# EAGLE design f1 (EAGLE 9.5.0)
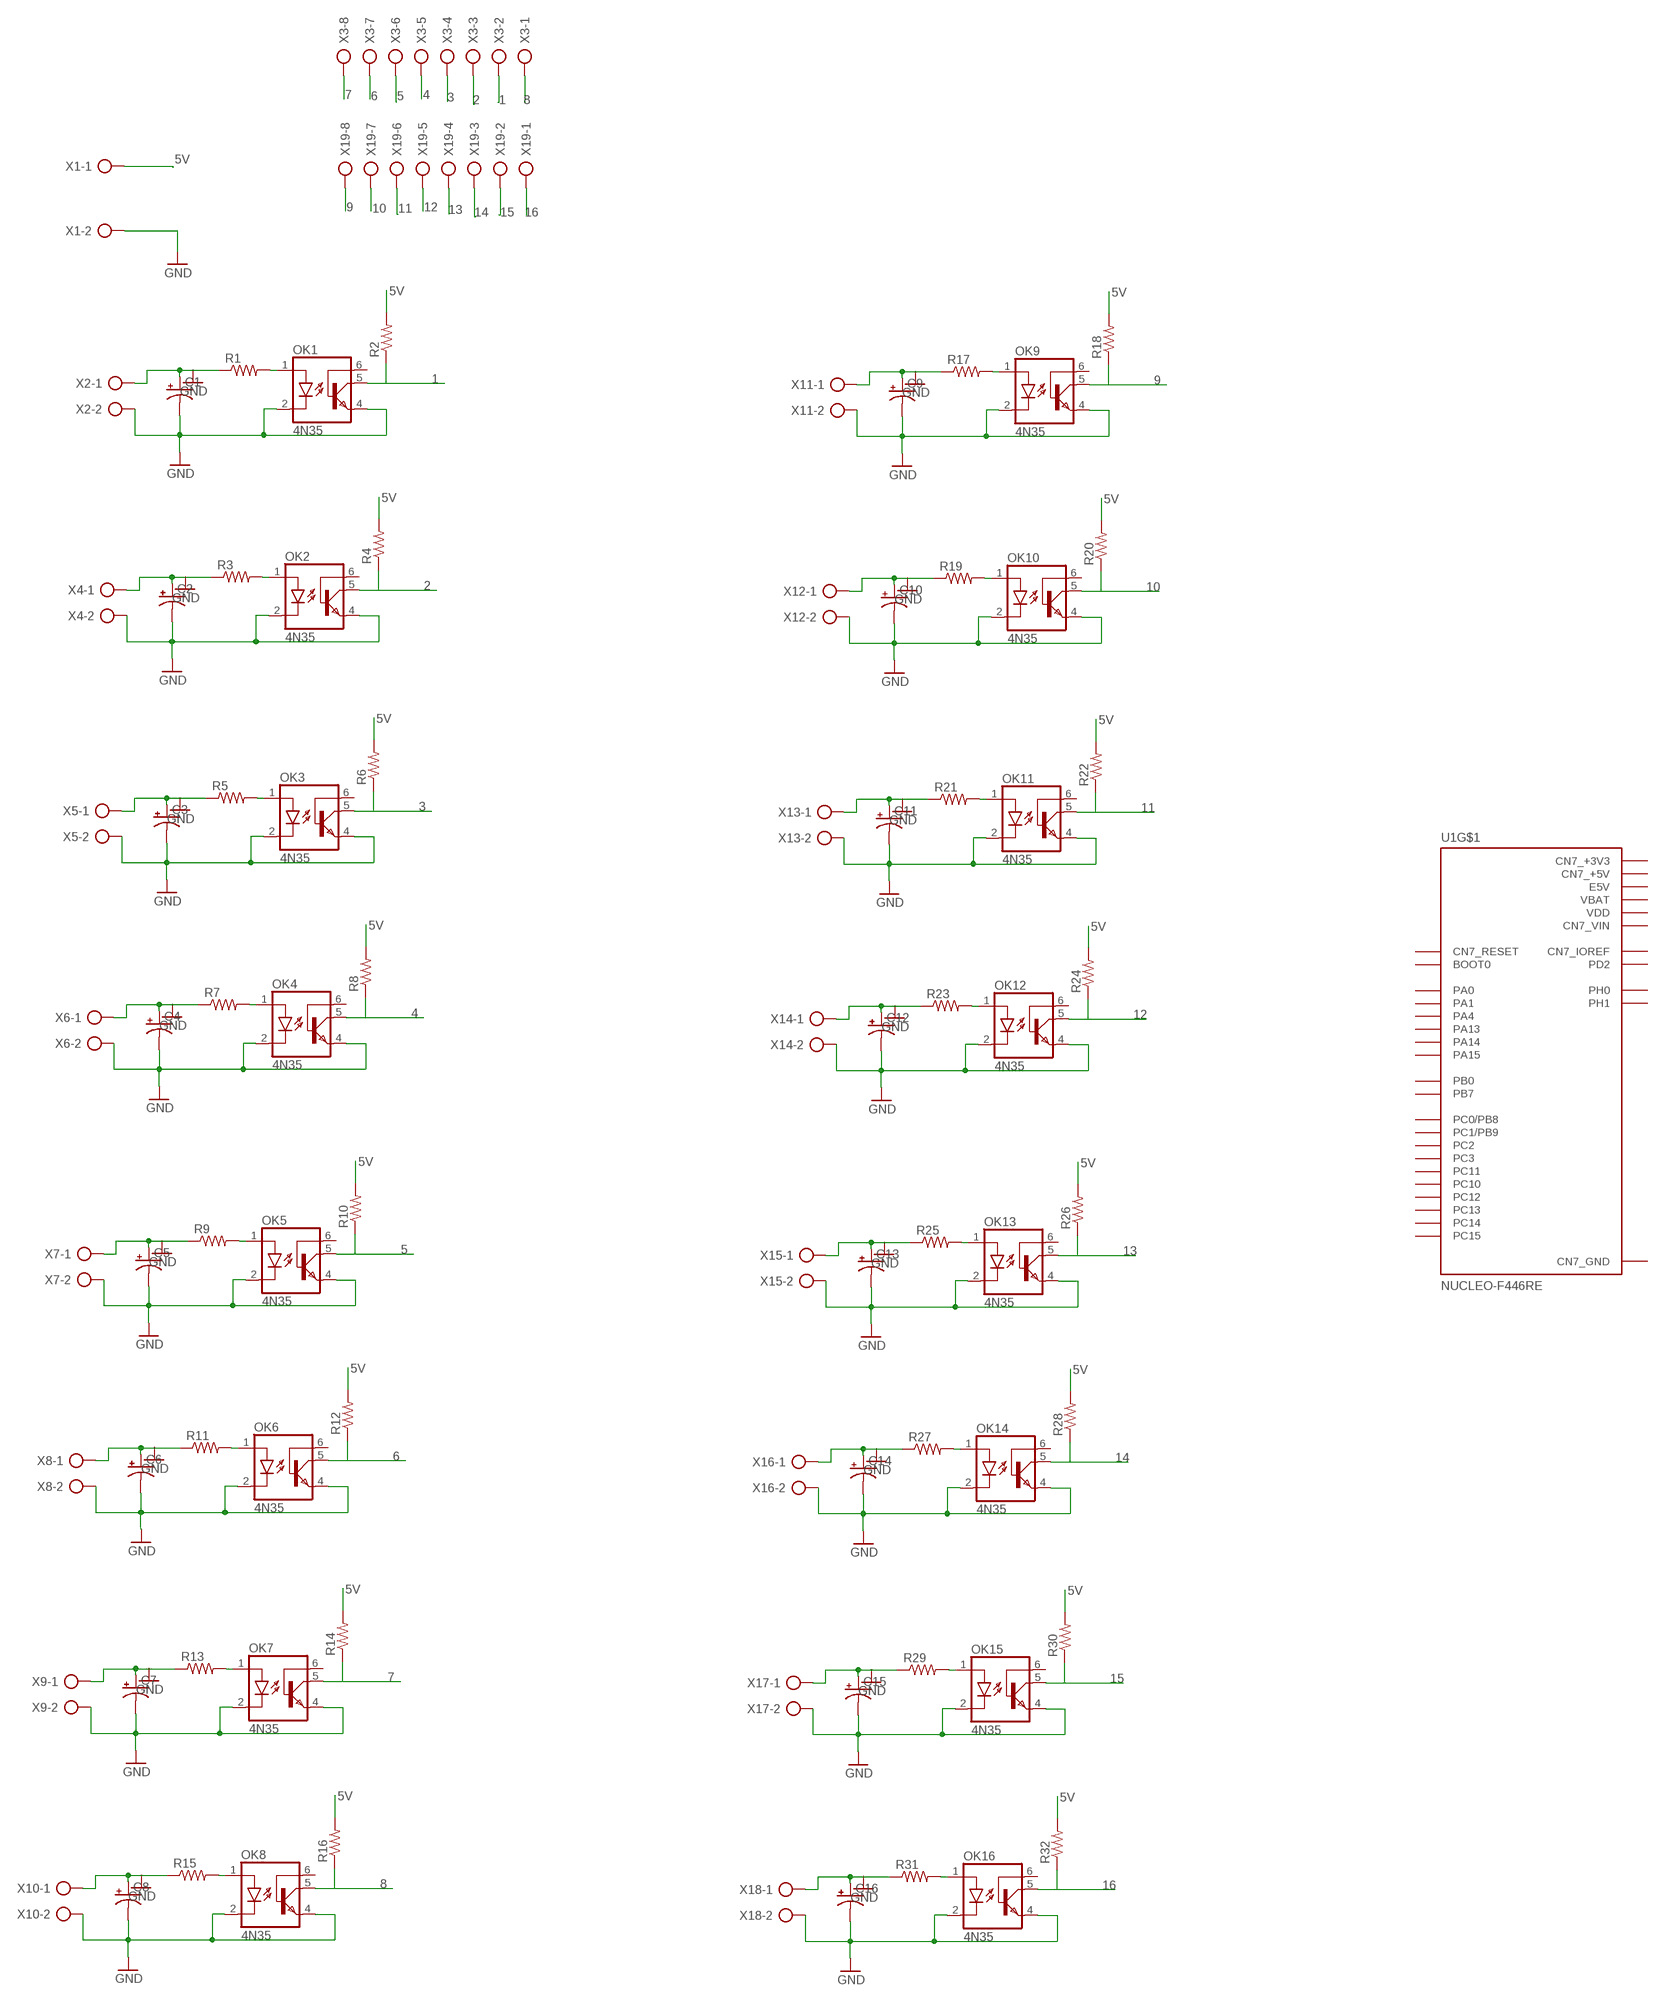
[diagram p0: schematic, sheet 1]

## Parts
C1  CPOL-USE3.5-10  [E3,5-10]
C2  CPOL-USE3.5-10  [E3,5-10]
C3  CPOL-USE3.5-10  [E3,5-10]
C4  CPOL-USE3.5-10  [E3,5-10]
C5  CPOL-USE3.5-10  [E3,5-10]
C6  CPOL-USE3.5-10  [E3,5-10]
C7  CPOL-USE3.5-10  [E3,5-10]
C8  CPOL-USE2.5-6  [E2,5-6]
C9  CPOL-USE3.5-10  [E3,5-10]
C10  CPOL-USE3.5-10  [E3,5-10]
C11  CPOL-USE3.5-10  [E3,5-10]
C12  CPOL-USE3.5-10  [E3,5-10]
C13  CPOL-USE3.5-10  [E3,5-10]
C14  CPOL-USE3.5-10  [E3,5-10]
C15  CPOL-USE3.5-10  [E3,5-10]
C16  CPOL-USE3.5-10  [E3,5-10]
OK1  4N35  [DIL06]
OK2  4N35  [DIL06]
OK3  4N35  [DIL06]
OK4  4N35  [DIL06]
OK5  4N35  [DIL06]
OK6  4N35  [DIL06]
OK7  4N35  [DIL06]
OK8  4N35  [DIL06]
OK9  4N35  [DIL06]
OK10  4N35  [DIL06]
OK11  4N35  [DIL06]
OK12  4N35  [DIL06]
OK13  4N35  [DIL06]
OK14  4N35  [DIL06]
OK15  4N35  [DIL06]
OK16  4N35  [DIL06]
R1  R-US_0207/10  [0207/10]
R2  R-US_0207/10  [0207/10]
R3  R-US_0207/10  [0207/10]
R4  R-US_0207/10  [0207/10]
R5  R-US_0207/10  [0207/10]
R6  R-US_0207/10  [0207/10]
R7  R-US_0207/10  [0207/10]
R8  R-US_0207/10  [0207/10]
R9  R-US_0207/10  [0207/10]
R10  R-US_0207/10  [0207/10]
R11  R-US_0207/10  [0207/10]
R12  R-US_0207/10  [0207/10]
R13  R-US_0207/10  [0207/10]
R14  R-US_0207/10  [0207/10]
R15  R-US_0207/10  [0207/10]
R16  R-US_0207/10  [0207/10]
R17  R-US_0207/10  [0207/10]
R18  R-US_0207/10  [0207/10]
R19  R-US_0207/10  [0207/10]
R20  R-US_0207/10  [0207/10]
R21  R-US_0207/10  [0207/10]
R22  R-US_0207/10  [0207/10]
R23  R-US_0207/10  [0207/10]
R24  R-US_0207/10  [0207/10]
R25  R-US_0207/10  [0207/10]
R26  R-US_0207/10  [0207/10]
R27  R-US_0207/10  [0207/10]
R28  R-US_0207/10  [0207/10]
R29  R-US_0207/10  [0207/10]
R30  R-US_0207/10  [0207/10]
R31  R-US_0207/10  [0207/10]
R32  R-US_0207/10  [0207/10]
U1  NUCLEO-F446RE  [MODULE_NUCLEO-F446RE]
X1  AK300/2  [AK300/2]
X2  AK300/2  [AK300/2]
X3  AK300/8  [AK300/8]
X4  AK300/2  [AK300/2]
X5  AK300/2  [AK300/2]
X6  AK300/2  [AK300/2]
X7  AK300/2  [AK300/2]
X8  AK300/2  [AK300/2]
X9  AK300/2  [AK300/2]
X10  AK300/2  [AK300/2]
X11  AK300/2  [AK300/2]
X12  AK300/2  [AK300/2]
X13  AK300/2  [AK300/2]
X14  AK300/2  [AK300/2]
X15  AK300/2  [AK300/2]
X16  AK300/2  [AK300/2]
X17  AK300/2  [AK300/2]
X18  AK300/2  [AK300/2]
X19  AK300/8  [AK300/8]

## Nets
1: OK1.5(COL) R2.1 X3.2
2: OK2.5(COL) R4.1 X3.3
3: OK3.5(COL) R6.1 X3.4
4: OK4.5(COL) R8.1 X3.5
5: OK5.5(COL) R10.1 X3.6
5V: R2.2 R4.2 R6.2 R8.2 R10.2 R12.2 R14.2 R16.2 R18.2 R20.2 R22.2 R24.2 R26.2 R28.2 R30.2 R32.2 X1.1
6: OK6.5(COL) R12.1 X3.7
7: OK7.5(COL) R14.1 X3.8
8: OK8.5(COL) R16.1 X3.1
9: OK9.5(COL) R18.1 X19.8
10: OK10.5(COL) R20.1 X19.7
11: OK11.5(COL) R22.1 X19.6
12: OK12.5(COL) R24.1 X19.5
13: OK13.5(COL) R26.1 X19.4
14: OK14.5(COL) R28.1 X19.3
15: OK15.5(COL) R30.1 X19.2
16: OK16.5(COL) R32.1 X19.1
GND: C1.- C2.- C3.- C4.- C5.- C6.- C7.- C8.- C9.- C10.- C11.- C12.- C13.- C14.- C15.- C16.- OK1.2(C) OK1.4(EMI) OK2.2(C) OK2.4(EMI) OK3.2(C) OK3.4(EMI) OK4.2(C) OK4.4(EMI) OK5.2(C) OK5.4(EMI) OK6.2(C) OK6.4(EMI) OK7.2(C) OK7.4(EMI) OK8.2(C) OK8.4(EMI) OK9.2(C) OK9.4(EMI) OK10.2(C) OK10.4(EMI) OK11.2(C) OK11.4(EMI) OK12.2(C) OK12.4(EMI) OK13.2(C) OK13.4(EMI) OK14.2(C) OK14.4(EMI) OK15.2(C) OK15.4(EMI) OK16.2(C) OK16.4(EMI) X1.2 X2.2 X4.2 X5.2 X6.2 X7.2 X8.2 X9.2 X10.2 X11.2 X12.2 X13.2 X14.2 X15.2 X16.2 X17.2 X18.2
N$1: C2.+ R3.1 X4.1
N$2: OK2.1(A) R3.2
N$5: C3.+ R5.1 X5.1
N$6: C1.+ R1.1 X2.1
N$7: OK1.1(A) R1.2
N$13: OK3.1(A) R5.2
N$14: C4.+ R7.1 X6.1
N$15: OK4.1(A) R7.2
N$16: C5.+ R9.1 X7.1
N$17: OK5.1(A) R9.2
N$18: C6.+ R11.1 X8.1
N$19: OK6.1(A) R11.2
N$20: C7.+ R13.1 X9.1
N$21: OK7.1(A) R13.2
N$22: C8.+ R15.1 X10.1
N$23: OK8.1(A) R15.2
N$24: C9.+ R17.1 X11.1
N$25: OK9.1(A) R17.2
N$26: C10.+ R19.1 X12.1
N$27: OK10.1(A) R19.2
N$28: C11.+ R21.1 X13.1
N$29: OK11.1(A) R21.2
N$30: C12.+ R23.1 X14.1
N$31: OK12.1(A) R23.2
N$32: C13.+ R25.1 X15.1
N$33: OK13.1(A) R25.2
N$34: C14.+ R27.1 X16.1
N$35: OK14.1(A) R27.2
N$36: C15.+ R29.1 X17.1
N$37: OK15.1(A) R29.2
N$38: C16.+ R31.1 X18.1
N$39: OK16.1(A) R31.2
Unconnected: OK1.6(BAS) OK2.6(BAS) OK3.6(BAS) OK4.6(BAS) OK5.6(BAS) OK6.6(BAS) OK7.6(BAS) OK8.6(BAS) OK9.6(BAS) OK10.6(BAS) OK11.6(BAS) OK12.6(BAS) OK13.6(BAS) OK14.6(BAS) OK15.6(BAS) OK16.6(BAS) U1.CN5_1(D8) U1.CN5_2(D9) U1.CN5_3(D10) U1.CN5_4(D11) U1.CN5_5(D12) U1.CN5_6(D13) U1.CN5_9(D14) U1.CN5_10(D15) U1.CN6_2(CN6_IOREF) U1.CN6_3(CN6_RESET) U1.CN7_1(PC10) U1.CN7_2(PC11) U1.CN7_3(PC12) U1.CN7_4(PD2) U1.CN7_7(BOOT0) U1.CN7_12(CN7_IOREF) U1.CN7_13(PA13) U1.CN7_14(CN7_RESET) U1.CN7_15(PA14) U1.CN7_17(PA15) U1.CN7_21(PB7) U1.CN7_23(PC13) U1.CN7_25(PC14) U1.CN7_27(PC15) U1.CN7_28(PA0) U1.CN7_29(PH0) U1.CN7_30(PA1) U1.CN7_31(PH1) U1.CN7_32(PA4) U1.CN7_34(PB0) U1.CN7_35(PC2) U1.CN7_36(PC1/PB9) U1.CN7_37(PC3) U1.CN7_38(PC0/PB8) U1.CN8_1(A0) U1.CN8_2(A1) U1.CN8_3(A2) U1.CN8_4(A3) U1.CN8_5(A4) U1.CN8_6(A5) U1.CN9_1(D0) U1.CN9_2(D1) U1.CN9_3(D2) U1.CN9_4(D3) U1.CN9_5(D4) U1.CN9_6(D5) U1.CN9_7(D6) U1.CN9_8(D7) U1.CN10_1(PC9) U1.CN10_2(PC8) U1.CN10_3(PB8) U1.CN10_4(PC6) U1.CN10_5(PB9) U1.CN10_6(PC5) U1.CN10_11(PA5) U1.CN10_12(PA12) U1.CN10_13(PA6) U1.CN10_14(PA11) U1.CN10_15(PA7) U1.CN10_16(PB12) U1.CN10_17(PB6) U1.CN10_19(PC7) U1.CN10_21(PA9) U1.CN10_22(PB2) U1.CN10_23(PA8) U1.CN10_24(PB1) U1.CN10_25(PB10) U1.CN10_26(PB15) U1.CN10_27(PB4) U1.CN10_28(PB14) U1.CN10_29(PB5) U1.CN10_30(PB13) U1.CN10_31(PB3) U1.CN10_33(PA10) U1.CN10_34(PC4) U1.CN10_35(PA2) U1.CN10_37(PA3)

## Power pins joined to a net without a drawn wire
AGND: U1.CN10_32(AGND)
AREF: U1.CN5_8(AREF)
AVDD: U1.CN10_7(AVDD)
CN5_GND: U1.CN5_7(CN5_GND)
CN6_+3V3: U1.CN6_4(CN6_+3V3)
CN6_+5V: U1.CN6_5(CN6_+5V)
CN6_GND: U1.CN6_6(CN6_GND) U1.CN6_7(CN6_GND)
CN6_VIN: U1.CN6_8(CN6_VIN)
CN7_+3V3: U1.CN7_16(CN7_+3V3)
CN7_+5V: U1.CN7_18(CN7_+5V)
CN7_GND: U1.CN7_8(CN7_GND) U1.CN7_19(CN7_GND) U1.CN7_20(CN7_GND) U1.CN7_22(CN7_GND)
CN7_VIN: U1.CN7_24(CN7_VIN)
CN10_GND: U1.CN10_9(CN10_GND) U1.CN10_20(CN10_GND)
E5V: U1.CN7_6(E5V)
U5V: U1.CN10_8(U5V)
VBAT: U1.CN7_33(VBAT)
VDD: U1.CN7_5(VDD)

## Library data of the parts
C1-C16 = rcl:CPOL-US: POLARIZED CAPACITOR, American symbol; SPICEPREFIX: C
OK1-OK16 = optocoupler:4N35: MOTOROLA OPTO COUPLER; MF: FAIRCHILD SEMICONDUCTOR; MPN: 4N35; OC_FARNELL: 1328375; OC_NEWARK: 72K9946
R1-R32 = rcl:R-US_: RESISTOR, American symbol; SPICEPREFIX: R
U1 = NUCLEO-F446RE:NUCLEO-F446RE: STM32 Nucleo-64 development board with STM32F446RET6 MCU, supports Arduino and ST morpho connectivity Check prices <https://pricing.snapeda.com/parts/NUCLEO-F446RE/STMicroelectronics/view-part?ref=eda>; AVAILABILITY: Warning; DESCRIPTION: STM32F446RE, mbed-Enabled Development Nucleo-64 STM32F4 ARM® Cortex®-M4 MCU 32-Bit Embedded Evaluation Board; MF: STMicroelectronics; MP: NUCLEO-F446RE; PACKAGE: None; PRICE: None; PURCHASE-URL: https://pricing.snapeda.com/search/part/NUCLEO-F446RE/?ref=eda
X1 X2 X4-X18 = con-ptr500:AK300/2: CONNECTOR; OC_FARNELL: unknown; OC_NEWARK: unknown
X3 X19 = con-ptr500:AK300/8: CONNECTOR; OC_FARNELL: unknown; OC_NEWARK: unknown

## Board
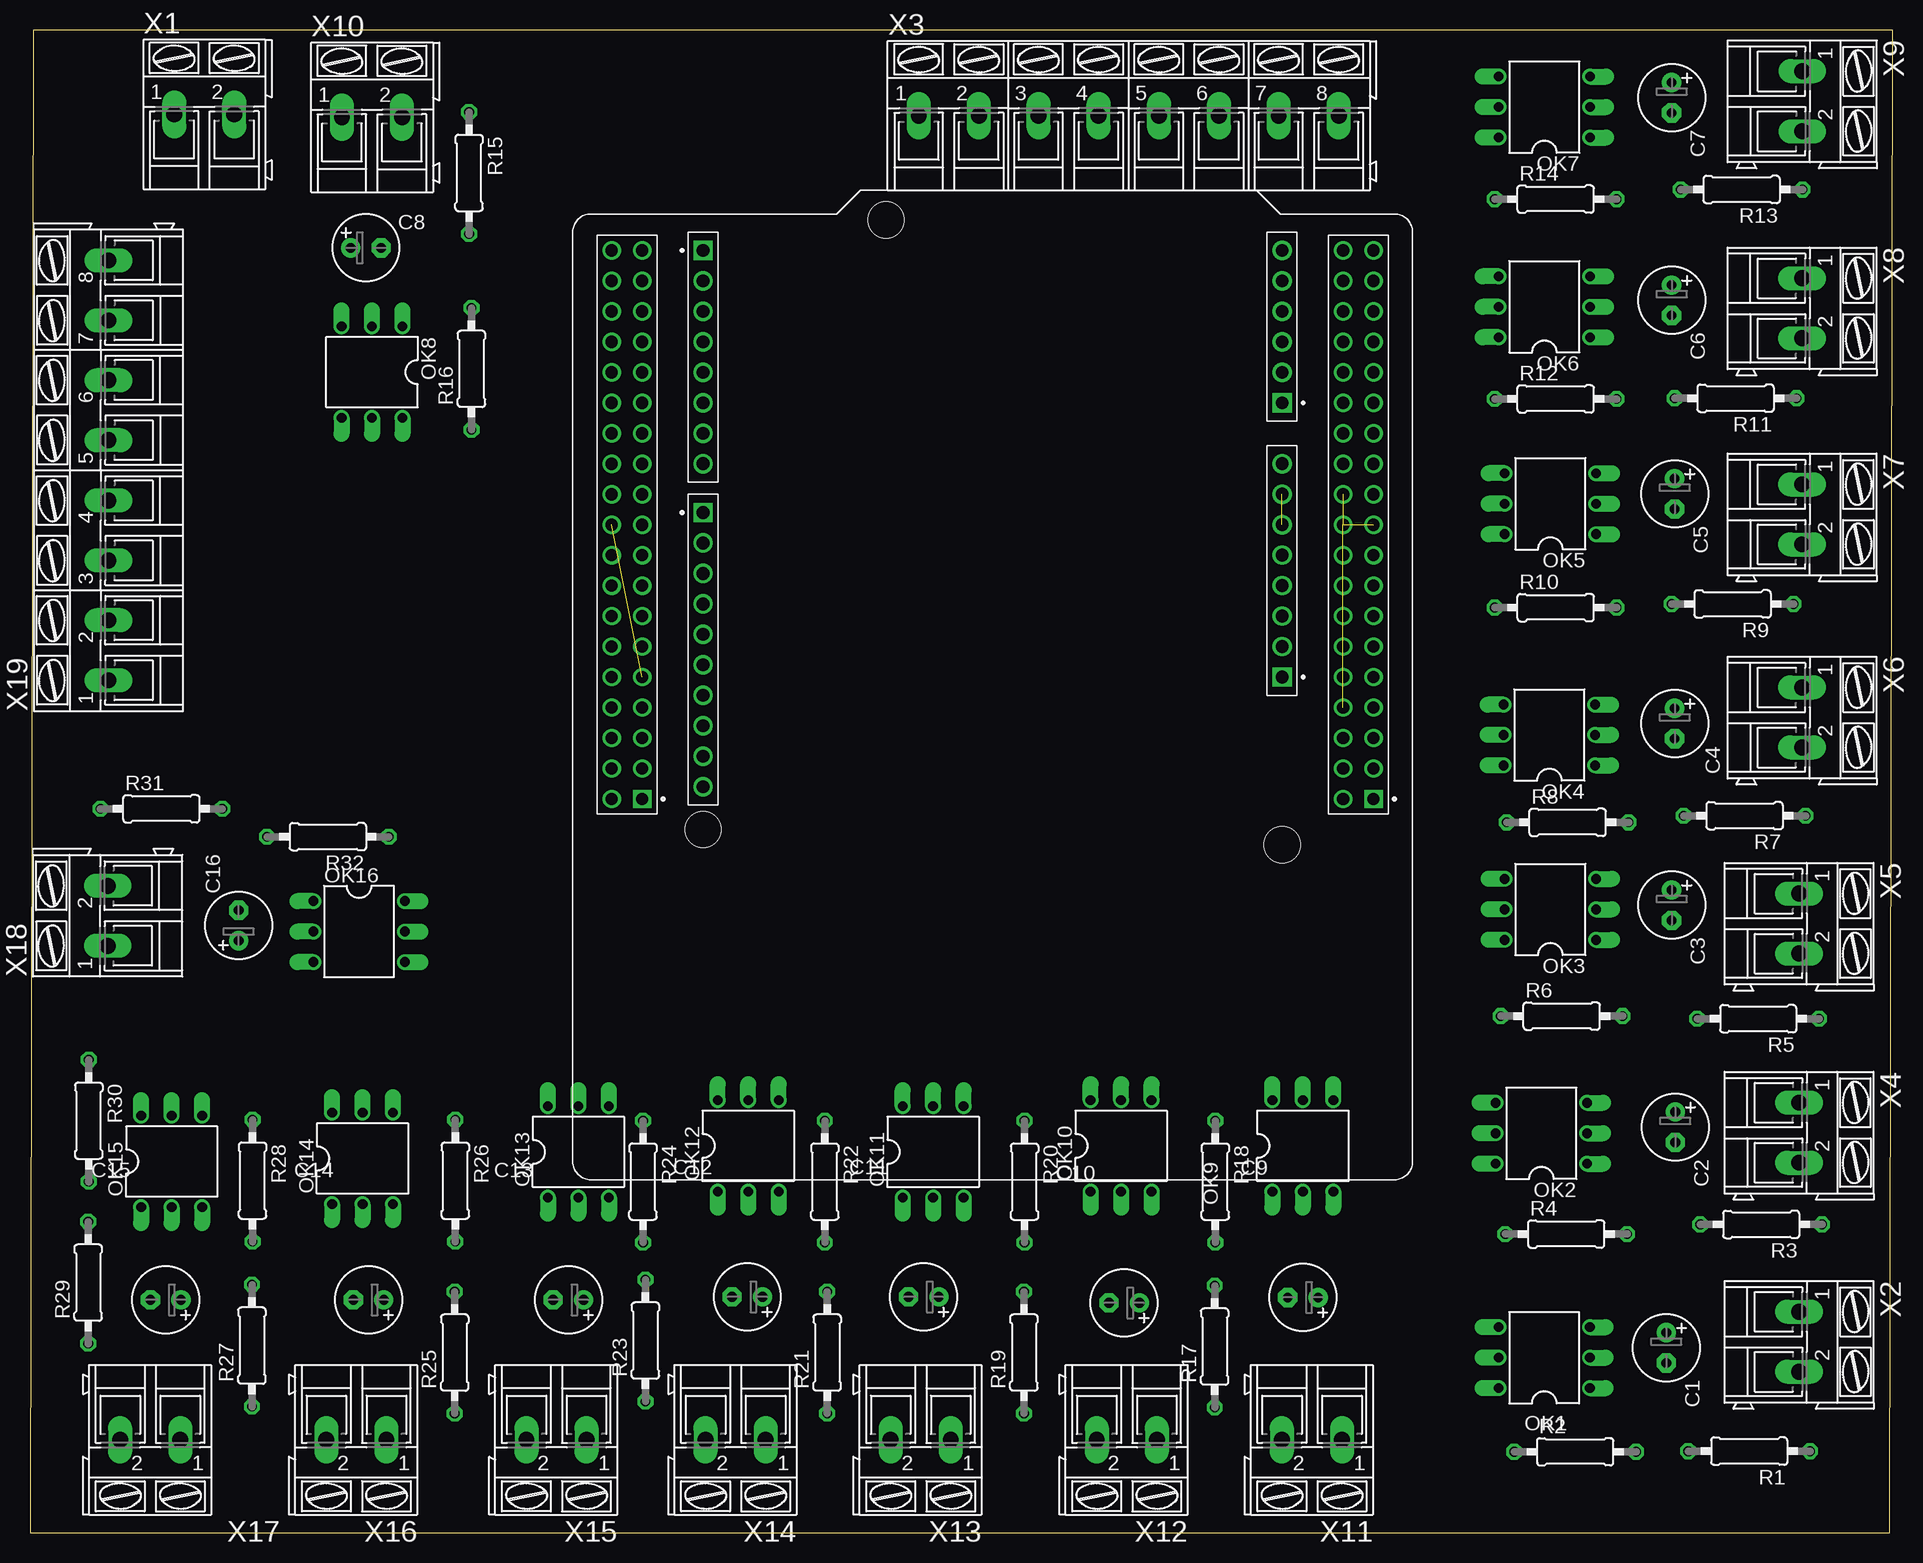
[diagram p1: board, top side]
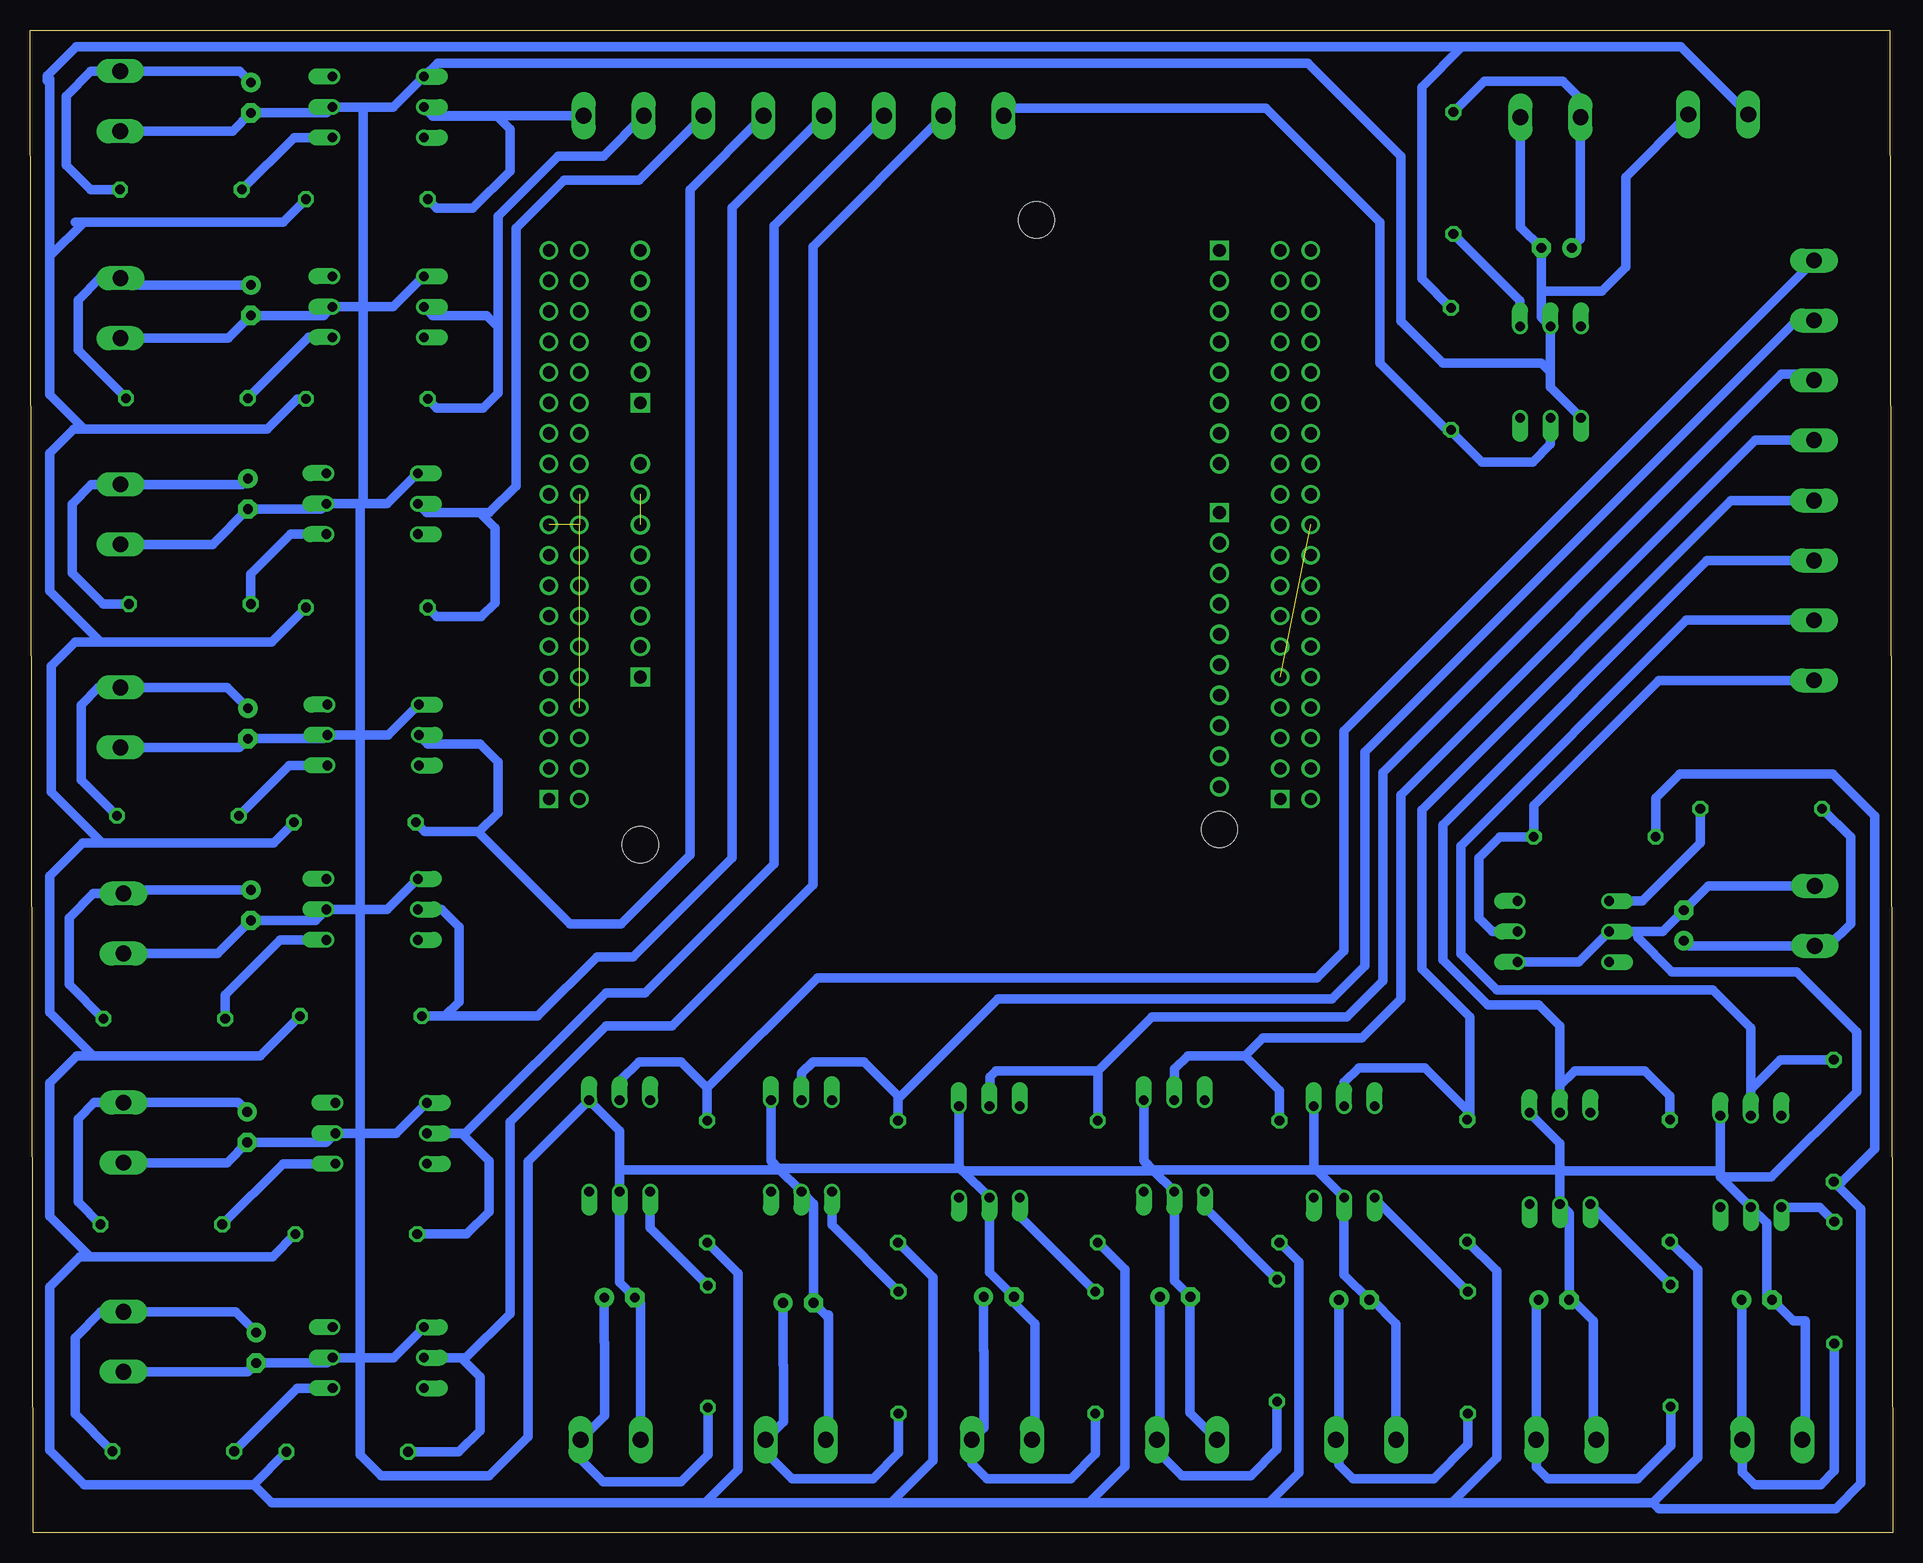
[diagram p2: board, bottom side, seen from below]

Size 155.25 x 125.25 mm. Coordinates in mm from the lower left corner, seen from the top.
Outline: 0,0 155,0 155.25,125.25 0.25,125.25 0,0
Copper layers (1*16): Top 0.035mm / dielectric 1.5mm / Bottom 0.035mm
Design rules "default": minimum track width 6mil, minimum drill 0.35mm, track to track 6mil, track to pad 6mil, pad to pad 6mil, via to via 6mil, smd to smd 6mil, copper to edge 40mil, drill to drill 6mil, minimum pad ring 10mil, minimum via ring 8mil, stop-mask expansion 4mil, vias tented up to drill 0mil, thermal gap 10mil

### Footprints (pad centres in the part's own frame; a part is rotated, then mirrored left to right if it is on the bottom)
E2,5-6 = drill 0.813 pad 1.6: + -1.27,0 | drill 0.813 pad 1.6 octagon: - 1.27,0
DIL06 = drill 0.813 offset: 1 -2.54,-3.81; 2 0,-3.81; 3 2.54,-3.81; 4 2.54,3.81; 5 0,3.81; 6 -2.54,3.81
0207/10 = drill 0.813 octagon: 1 -5.08,0; 2 5.08,0
MODULE_NUCLEO-F446RE = drill 1.07 square: CN5_1 24.13,-14.37; CN6_1 -24.13,-0.65; CN8_1 -24.13,-23.51; CN9_1 24.13,-36.21 | drill 1.07: CN5_2 24.13,-11.83; CN5_3 24.13,-9.29; CN5_4 24.13,-6.75; CN5_5 24.13,-4.21; CN5_6 24.13,-1.67; CN5_7 24.13,0.87; CN5_8 24.13,3.41; CN5_9 24.13,5.95; CN5_10 24.13,8.49; CN6_2 -24.13,-3.19; CN6_3 -24.13,-5.73; CN6_4 -24.13,-8.27; CN6_5 -24.13,-10.81; CN6_6 -24.13,-13.35; CN6_7 -24.13,-15.89; CN6_8 -24.13,-18.43; CN8_2 -24.13,-26.05; CN8_3 -24.13,-28.59; CN8_4 -24.13,-31.13; CN8_5 -24.13,-33.67; CN8_6 -24.13,-36.21; CN9_2 24.13,-33.67; CN9_3 24.13,-31.13; CN9_4 24.13,-28.59; CN9_5 24.13,-26.05; CN9_6 24.13,-23.51; CN9_7 24.13,-20.97; CN9_8 24.13,-18.43 | drill 1.02 square: CN7_1 -31.75,9.51; CN10_1 29.21,9.51 | drill 1.02: CN7_2 -29.21,9.51; CN7_3 -31.75,6.97; CN7_4 -29.21,6.97; CN7_5 -31.75,4.43; CN7_6 -29.21,4.43; CN7_7 -31.75,1.89; CN7_8 -29.21,1.89; CN7_9 -31.75,-0.65; CN7_10 -29.21,-0.65; CN7_11 -31.75,-3.19; CN7_12 -29.21,-3.19; CN7_13 -31.75,-5.73; CN7_14 -29.21,-5.73; CN7_15 -31.75,-8.27; CN7_16 -29.21,-8.27; CN7_17 -31.75,-10.81; CN7_18 -29.21,-10.81; CN7_19 -31.75,-13.35; CN7_20 -29.21,-13.35; CN7_21 -31.75,-15.89; CN7_22 -29.21,-15.89; CN7_23 -31.75,-18.43; CN7_24 -29.21,-18.43; CN7_25 -31.75,-20.97; CN7_26 -29.21,-20.97; CN7_27 -31.75,-23.51; CN7_28 -29.21,-23.51; CN7_29 -31.75,-26.05; CN7_30 -29.21,-26.05; CN7_31 -31.75,-28.59; CN7_32 -29.21,-28.59; CN7_33 -31.75,-31.13; CN7_34 -29.21,-31.13; CN7_35 -31.75,-33.67; CN7_36 -29.21,-33.67; CN7_37 -31.75,-36.21; CN7_38 -29.21,-36.21; CN10_2 31.75,9.51; CN10_3 29.21,6.97; CN10_4 31.75,6.97; CN10_5 29.21,4.43; CN10_6 31.75,4.43; CN10_7 29.21,1.89; CN10_8 31.75,1.89; CN10_9 29.21,-0.65; CN10_10 31.75,-0.65; CN10_11 29.21,-3.19; CN10_12 31.75,-3.19; CN10_13 29.21,-5.73; CN10_14 31.75,-5.73; CN10_15 29.21,-8.27; CN10_16 31.75,-8.27; CN10_17 29.21,-10.81; CN10_18 31.75,-10.81; CN10_19 29.21,-13.35; CN10_20 31.75,-13.35; CN10_21 29.21,-15.89; CN10_22 31.75,-15.89; CN10_23 29.21,-18.43; CN10_24 31.75,-18.43; CN10_25 29.21,-20.97; CN10_26 31.75,-20.97; CN10_27 29.21,-23.51; CN10_28 31.75,-23.51; CN10_29 29.21,-26.05; CN10_30 31.75,-26.05; CN10_31 29.21,-28.59; CN10_32 31.75,-28.59; CN10_33 29.21,-31.13; CN10_34 31.75,-31.13; CN10_35 29.21,-33.67; CN10_36 31.75,-33.67; CN10_37 29.21,-36.21; CN10_38 31.75,-36.21 | hole 3: 8.89,-38.75; 24.13,12.05; -24.13,13.32
AK300/2 = drill 1.321 long: 1 -2.515,0; 2 2.489,0
AK300/8 = drill 1.321 long: 1 -17.501,0; 2 -12.497,0; 3 -7.518,0; 4 -2.515,0; 5 2.515,0; 6 7.518,0; 7 12.497,0; 8 17.501,0

### Placement (x,y rotation side)
C1  [E2,5-6]  136.39,15.4 270 top
C2  [E2,5-6]  137.14,33.79 270 top
C3  [E2,5-6]  136.84,52.3 270 top
C4  [E2,5-6]  137.09,67.44 270 top
C5  [E2,5-6]  137.09,86.58 270 top
C6  [E2,5-6]  136.84,102.72 270 top
C7  [E2,5-6]  136.84,119.61 270 top
C8  28,107.09 0 top
C9  [E2,5-6]  106.11,19.59 180 top
C10  [E2,5-6]  91.2,19.14 180 top
C11  [E2,5-6]  74.49,19.64 180 top
C12  [E2,5-6]  59.79,19.64 180 top
C13  [E2,5-6]  44.88,19.39 180 top
C14  [E2,5-6]  28.22,19.39 180 top
C15  [E2,5-6]  11.31,19.39 180 top
C16  [E2,5-6]  17.39,50.6 90 top
OK1  126.22,14.58 90 top
OK2  125.98,33.28 90 top
OK3  126.73,51.94 90 top
OK4  126.65,66.48 90 top
OK5  126.73,85.76 90 top
OK6  126.23,102.17 90 top
OK7  126.23,118.83 90 top
OK8  28.51,96.73 180 top
OK9  106.1,32.23 0 top
OK10  90.94,32.23 0 top
OK11  75.28,31.73 0 top
OK12  59.87,32.23 0 top
OK13  45.71,31.73 0 top
OK14  27.72,31.18 0 top
OK15  11.81,30.93 0 top
OK16  27.43,50.1 270 top
R1  143.3,6.78 180 top
R2  128.8,6.73 0 top
R3  144.3,25.68 180 top
R4  128.05,24.88 0 top
R5  144.05,42.83 180 top
R6  127.67,43.05 0 top
R7  142.92,59.75 180 top
R8  128.17,59.2 0 top
R9  141.92,77.4 180 top
R10  127.17,77.1 0 top
R11  142.17,94.55 180 top
R12  127.17,94.5 0 top
R13  142.67,111.95 180 top
R14  127.17,111.15 0 top
R15  36.6,113.33 270 top
R16  36.8,97 90 top
R17  98.75,15.5 90 top
R18  98.8,29.25 270 top
R19  82.85,15 90 top
R20  82.9,29.25 270 top
R21  66.45,15 90 top
R22  66.25,29.25 270 top
R23  51.3,16 90 top
R24  51.1,29.25 270 top
R25  35.4,15 90 top
R26  35.45,29.33 270 top
R27  18.5,15.58 90 top
R28  18.55,29.33 270 top
R29  4.85,20.83 90 top
R30  4.9,34.33 270 top
R31  10.95,60.33 0 top
R32  24.83,58 180 top
U1  80.24,70.66 180 top
X1  14.54,118.21 0 top
X2  147.46,15.89 270 top
X3  91.59,118.1 0 top
X4  147.46,33.32 270 top
X5  147.46,50.75 270 top
X6  147.71,67.93 270 top
X7  147.71,84.86 270 top
X8  147.71,102.04 270 top
X9  147.72,119.3 270 top
X10  28.52,117.97 0 top
X11  106.84,7.72 180 top
X12  91.41,7.72 180 top
X13  74.23,7.72 180 top
X14  58.8,7.72 180 top
X15  43.87,7.72 180 top
X16  27.19,7.72 180 top
X17  10.01,7.72 180 top
X18  6.47,51.42 90 top
X19  6.54,88.54 90 top

### Tracks (layer width: path | path; a pad name or v marks a point on that pad's centre or on a via)
1
  Bottom 0.8: OK1.5 119.33,14.58 | 119.33,14.58 117.75,13 117.75,8.5 119.52,6.73 R2.1 | X3.2 90,107.19 90,54 101.75,42.25 107.25,42.25 115.25,34.25 115.25,18.25 118.92,14.58 119.33,14.58
2
  Bottom 0.8: R4.1 118.87,24.88 117,26.75 117,31 119.28,33.28 OK2.5 118.97,33.28 107.25,45 104,45 93.25,55.75 93.25,108.92 X3.3
3
  Bottom 0.8: X3.4 96.75,110.42 96.75,56.25 105,48 108,48 112.95,43.05 R6.1 120.7,43.05 119.5,44.25 119.5,50.5 120.94,51.94 OK3.5
4
  Bottom 0.8: OK4.5 122.09,65.73 117.73,65.73 116.25,64.25 116.25,60 117.8,58.45 117.95,58.45 | R8.1 122.34,58.45 120.25,58.45 117.95,58.45 | X3.5 100.25,111.95 100.25,56.5 106,50.75 110.25,50.75 117.95,58.45
5
  Bottom 0.8: OK5.5 122.17,85.01 117.76,85.01 | 117.76,85.01 116.5,83.75 116.5,77.5 117.65,76.35 121.34,76.35 R10.1 | X3.6 104.46,112.75 110.75,112.75 114.75,108.75 114.75,87.25 116.99,85.01 117.76,85.01
5V
  Bottom 0.8: R14.2 134.15,109.25 150.75,109.25 | 150.75,109.25 151.5,109.25 | 150.75,109.25 153.58,106.42 | 150.75,92 135.5,92 133,94.5 R12.2 | 153.58,106.42 153.58,94.83 150.75,92 | R10.2 135.1,74.25 149.33,74.25 | 149.33,74.25 153.58,78.5 153.58,90 151.58,92 150.75,92 | R8.2 134.95,57.5 149.25,57.5 | 149.25,57.5 153.5,61.75 153.5,72.25 151.5,74.25 149.33,74.25 | R6.2 136.05,39.75 150,39.75 | 150,39.75 153.58,43.33 153.58,54.75 150.83,57.5 149.25,57.5 | R4.2 135.01,23 150.25,23 | 150.25,23 153.58,26.33 153.58,37.5 151.33,39.75 150,39.75 | R2.2 136.61,4 | 136.61,4 150.75,4 153.58,6.83 153.58,20.5 151.08,23 150.25,23 | R16.2 39.25,104.53 39.25,120.5 35.92,123.83 | 35.92,123.83 17.65,123.83 X1.1 | R32.2 19.75,61.25 17.75,63.25 5,63.25 1.5,59.75 1.5,32 4.25,29.25 R30.2 2.65,27 2.65,4.1 4.75,2 19.5,2 20,2.5 | R18.2 96.25,21.62 96.25,5.25 99,2.5 | 136.61,4 135.11,2.5 99,2.5 | R20.2 80,21.27 80,6 83.5,2.5 | 83.5,2.5 99,2.5 | R22.2 64,21.92 64,5.5 67,2.5 | 67,2.5 83.5,2.5 | R24.2 49.5,22.57 49.5,5 52,2.5 | 52,2.5 67,2.5 | R26.2 33,21.8 33,6.25 36.75,2.5 | 36.75,2.5 52,2.5 | R28.2 16.25,21.95 16.25,6.25 20,2.5 | 20,2.5 36.75,2.5 | 35.92,123.83 151.42,123.83 153.83,121.42 | 153.83,121 153.83,121.42 | 153.83,121.42 153.58,121.18 153.58,106.42
6
  Bottom 0.8: OK6.5 121.67,101.42 117.17,101.42 116.25,100.5 | 116.25,100.5 116.25,95 117.5,93.75 121.34,93.75 R12.1 | X3.7 107.44,114.75 111.25,114.75 116.25,109.75 116.25,100.5
7
  Bottom 0.8: R14.1 121.34,110.4 118.35,110.4 115.25,113.5 115.25,117 116.33,118.08 121.67,118.08 OK7.5 121.69,118.1 X3.8
8
  Bottom 0.8: X3.1 73.44,118.75 52.25,118.75 42.75,109.25 42.75,97.5 36.92,91.67 36.92,91.8 R16.1 36.8,91.8 34.25,89.25 30,89.25 28.51,90.74 OK8.5
9
  Bottom 0.8: R18.1 98.8,37.05 | 98.8,37.05 101,39.25 104.5,39.25 106.1,37.65 OK9.5 | X19.8 45.75,66.83 45.75,48.5 48,46.25 89.6,46.25 98.8,37.05
10
  Bottom 0.8: R20.1 82.9,36.15 | 82.9,36.15 82.9,36.4 85.75,39.25 90,39.25 90.94,38.31 OK10.5 | 82.9,36.15 74.55,44.5 46.75,44.5 44,47.25 44,65.08 8.04,101.04 X19.7
11
  Bottom 0.8: 66.25,38.5 R22.1 | X19.6 7.04,96.56 9.29,96.56 42.5,63.35 42.5,46 45.5,43 61.75,43 66.25,38.5 | OK11.5 75.25,35.57 75.25,38 74.75,38.5 66.25,38.5
12
  Bottom 0.8: R24.1 51.1,36.85 54,39.75 | 54,39.75 58.75,39.75 59.87,38.63 OK12.5 | X19.5 11.45,91.06 41,61.5 41,44.5 44.25,41.25 52.5,41.25 54,39.75
13
  Bottom 0.8: OK13.5 45.71,37.54 44.5,38.75 39,38.75 35.45,35.2 R26.1 35.25,34.61 35.25,43 39.25,47 39.25,60.25 13.47,86.03 X19.4
14
  Bottom 0.8: R28.1 18.55,36.41 20.64,38.5 26.5,38.5 27.72,37.28 | 27.72,37.28 OK14.5 | 27.72,37.28 27.72,42.22 29.5,44 33.75,44 37.5,47.75 37.5,59 15.48,81.02 X19.3
15
  Bottom 0.8: 11.81,36.94 OK15.5 | R30.1 9.34,39.41 11.81,36.94 | 11.81,36.94 11.81,42.06 15,45.25 33,45.25 36,48.25 36,57.25 17.21,76.04 X19.2
16
  Bottom 0.8: OK16.5 33.35,50.1 34.5,51.25 34.5,56.25 32.75,58 R32.1 29.91,60.59 19.46,71.04 X19.1
CN6_GND  (1 unrouted)
CN7_GND  (3 unrouted)
CN10_GND  (1 unrouted)
GND
  Bottom 0.8: X10.2 31.01,108.83 C8.- 29.27,103.75 | X9.2 138.37,116.81 C7.- | X8.2 138.74,99.55 C6.- | X7.2 140.03,82.37 C5.- 130.99,85.31 OK5.2 127.5,85.76 | X6.2 137.82,65.44 C4.- 130.77,66.17 OK4.2 127.75,66.48 | X5.2 139.61,48.26 C3.- 131.45,51.03 OK3.2 127.75,51.94 | X4.2 138.83,30.83 C2.- 130.55,32.52 OK2.2 127.75,33.28 | X2.2 137.12,13.4 C1.- 130.48,14.13 OK1.2 127.75,14.58 | C6.- 135.55,101.45 | C7.- 134.91,118.34 | 127.75,33.28 124.71,33.28 OK2.4 | 127.75,51.94 125.46,51.94 OK3.4 | 127.75,66.48 125.38,66.48 OK4.4 | 127.5,85.76 125.46,85.76 OK5.4 | C6.- 130.76,101.45 OK6.2 127.5,102.17 | 127.5,102.17 124.96,102.17 OK6.4 | C7.- 130.53,118.34 OK7.2 127.5,118.83 | 127.5,118.83 124.96,118.83 OK7.4 121.29,122.5 48.75,122.5 41,114.75 41,101 37.5,97.5 29.26,97.5 28.51,96.75 | 127.75,14.58 124.95,14.58 OK1.4 | 29.27,103.75 29.27,101.3 OK8.2 28.51,96.75 | 28.51,96.75 28.51,95.46 OK8.4 | 21.25,50.1 19.16,50.1 C16.- 15.35,53.91 X18.2 | 21.25,50.1 OK16.2 26.16,47.56 OK16.4 | X17.2 7.27,7.97 7.27,17.64 8.29,17.64 C15.- 10.48,19.83 10.48,25.79 OK15.2 14.35,29.66 | 14.35,30.16 14.35,29.66 | 14.35,30.16 OK15.4 | X16.2 24.95,7.97 24.95,17.64 26.7,19.39 C14.- 26.95,26.6 OK14.2 27.72,30.25 | 27.72,30.5 27.72,32.45 OK14.4 | 27.72,30.25 27.72,30.5 | X15.2 41.38,17.41 43.36,19.39 C13.- 45.71,21.49 OK13.2 48.04,30.25 | 48.04,30.25 48.25,30.46 OK13.4 | X14.2 58.56,9.97 58.56,19.68 C12.- 59.87,20.99 OK12.2 61.6,30.15 | 61.6,30.15 62.41,30.96 OK12.4 | X13.2 71.49,7.97 71.49,17.41 73.22,19.14 C11.- 75.28,21.7 OK11.2 77.51,30.15 | 77.51,30.15 77.82,30.46 | OK11.4 77.82,30.46 | X12.2 88.67,7.97 88.67,18.13 88.8,18.01 C10.- 89.93,27.41 OK10.2 92.89,30.36
  Bottom 0.8: 92.89,30.36 93.48,30.96 OK10.4 | X11.2 104.35,19.1 C9.- 106.1,20.85 OK9.2 106.1,30.25 | 106.1,30.25 106.1,33.5 OK9.4 113.75,30.93 113.75,8 117,4.75 126,4.75 127.75,6.5 127.75,14.58 | X1.2 22.25,112.99 22.25,105.5 24.25,103.5 29.02,103.5 29.27,103.75 | 14.35,30.16 27.38,30.16 27.72,30.5 | 27.72,30.25 48.04,30.25 | 48.04,30.25 61.5,30.25 61.6,30.15 | 61.6,30.15 77.51,30.15 | 77.82,30.46 77.92,30.36 92.89,30.36 | 92.89,30.36 93,30.25 106.1,30.25 | 127.75,14.58 127.75,33.28 | 127.75,33.28 127.75,51.94 | 127.75,51.94 127.75,66.48 | 127.75,66.48 127.75,85.51 127.5,85.76 | 127.5,85.76 127.5,102.17 | 127.5,102.17 127.5,118.83 | 14.35,29.66 10.09,29.66 3,36.75 3,41.75 8,46.75 18.4,46.75 21.25,49.6 21.25,50.1
N$1
  Bottom 0.8: C2.+ 137.91,35.84 X4.1 149.91,35.84 151.25,34.5 151.25,27.55 R3.1
N$2
  Bottom 0.8: R3.2 134.16,30.74 OK2.1
N$5
  Bottom 0.8: C3.+ 147.16,53.57 X5.1 149.99,53.27 152,51.25 152,45.7 R5.1
N$6
  Bottom 0.8: C1.+ 138.12,18.41 X2.1 149.34,18.41 151.5,16.25 151.5,9.9 R1.1
N$7
  Bottom 0.8: R1.2 132.96,12.04 OK1.1
N$13
  Bottom 0.8: R5.2 138.97,44.83 134.4,49.4 OK3.1
N$14
  Bottom 0.8: C4.+ 138.82,70.44 X6.1 149.56,70.44 151,69 151,62.75 R7.1
N$15
  Bottom 0.8: R7.2 133.65,63.94 OK4.1
N$16
  Bottom 0.8: C5.+ 137.56,87.38 X7.1 150.12,87.38 151.75,85.75 151.75,80 149.15,77.4 R9.1
N$17
  Bottom 0.8: R9.2 136.84,79.9 133.52,83.22 OK5.1
N$18
  Bottom 0.8: C6.+ 147.15,103.99 X8.1 149.44,104.56 151.25,102.75 151.25,98.55 R11.1
N$19
  Bottom 0.8: R11.2 132.01,99.63 OK6.1
N$20
  Bottom 0.8: C7.+ 137.78,121.81 X9.1 150.19,121.81 152.25,119.75 152.25,114 150.2,111.95 R13.1
N$21
  Bottom 0.8: R13.2 133.25,116.29 OK7.1
N$22
  Bottom 0.8: C8.+ 26,107.81 X10.1 26,119.5 27.5,121 34.01,121 R15.1
N$23
  Bottom 0.8: R15.2 31.05,102.7 OK8.1
N$24
  Bottom 0.8: C9.+ 107.38,15.89 107.36,15.87 107.36,9.72 X11.1 109.36,6.11 107.5,4.25 101,4.25 98.75,6.5 R17.1
N$25
  Bottom 0.8: R17.2 103.56,25.39 OK9.1
N$26
  Bottom 0.8: C10.+ 92.47,13.98 92.42,13.94 92.42,9.22 X12.1 93.92,6.67 91.75,4.5 85,4.5 82.85,6.65 R19.1
N$27
  Bottom 0.8: R19.2 88.4,25.63 OK10.1
N$28
  Bottom 0.8: C11.+ 75.76,15.17 75.75,15.15 75.75,8.72 X13.1 76.75,5.75 75.5,4.5 68.5,4.5 66.45,6.55 R21.1
N$29
  Bottom 0.8: R21.2 72.74,26.37 OK11.1
N$30
  Bottom 0.8: C12.+ 61.06,7.97 | 61.06,7.97 X14.1 | R23.1 51.3,6.95 53.5,4.75 59.25,4.75 61.06,6.56 61.06,7.97
N$31
  Bottom 0.8: R23.2 57.33,27.11 OK12.1
N$32
  Bottom 0.8: C13.+ 46.15,7.96 | 46.15,7.96 X15.1 | R25.1 35.4,7.35 38.25,4.5 45,4.5 46.15,5.65 46.15,7.96
N$33
  Bottom 0.8: R25.2 43.17,27.85 OK13.1
N$34
  Bottom 0.8: C14.+ 29.7,19.18 X16.1 29.7,5.46 28.75,4.5 21.25,4.5 18.5,7.25 R27.1
N$35
  Bottom 0.8: R27.2 25.18,27.34 OK14.1
N$36
  Bottom 0.8: C15.+ 12.58,7.78 X17.1 12.53,5.03 11.5,4 6,4 4.85,5.15 R29.1
N$37
  Bottom 0.8: R29.2 6.06,27.12 OK15.1
N$38
  Bottom 0.8: C16.+ 16.96,48.91 X18.1 5.34,48.91 3.5,50.75 3.5,57.96 R31.1
N$39
  Bottom 0.8: R31.2 16.03,57.47 20.86,52.64 OK16.1